# EAGLE design fatayshield (EAGLE 9.6.0)
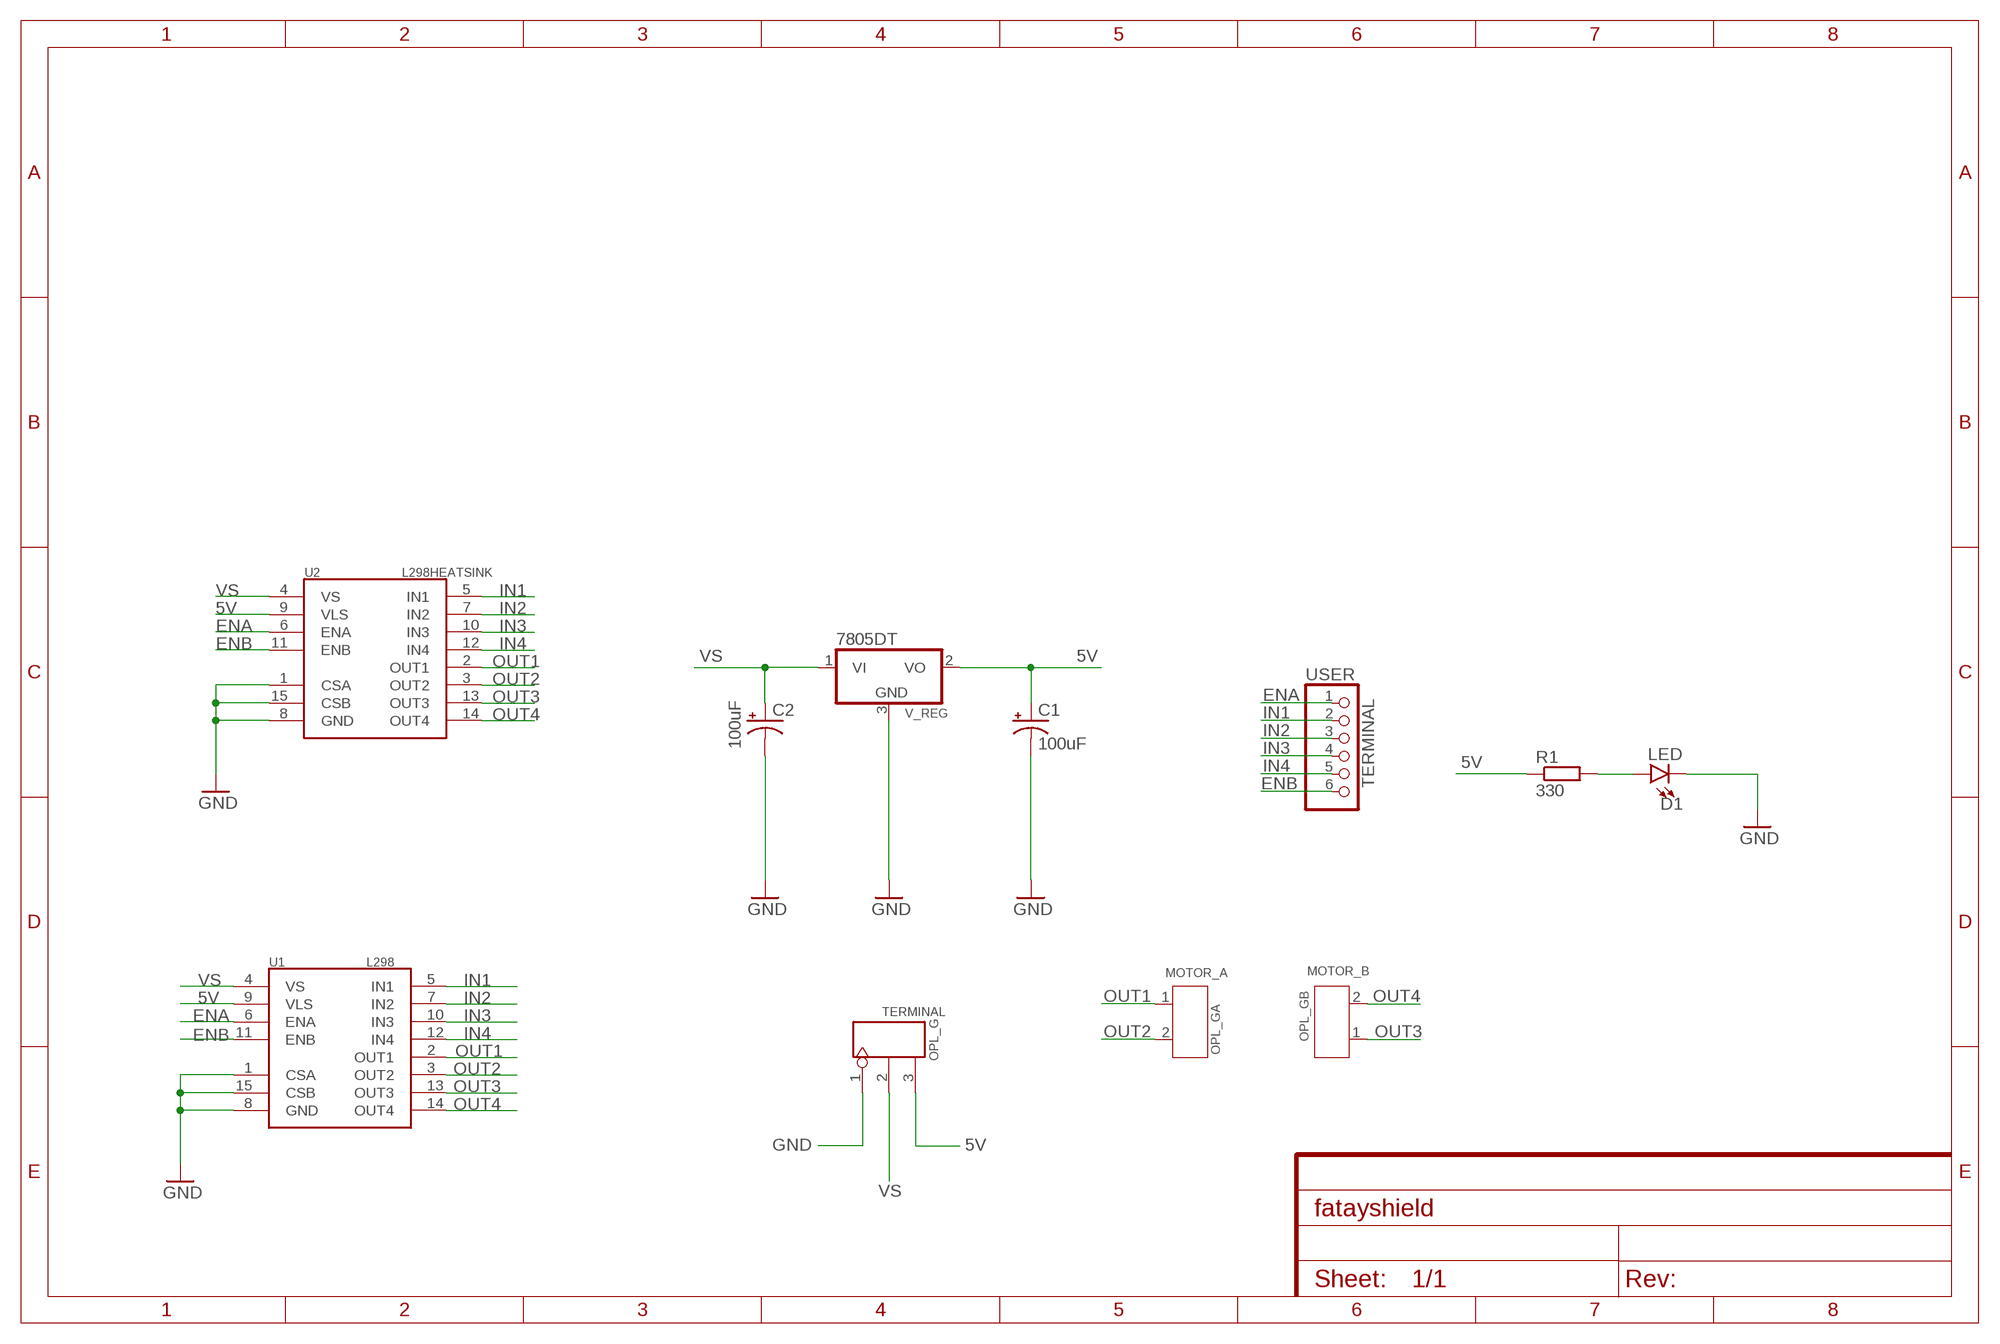
[diagram p0: schematic, sheet 1]

## Parts
C1  100uF  CPOL-USD  [PANASONIC_D]
C2  100uF  CPOL-USD  [PANASONIC_D]
D1  LED  LED-RED0603  [LED-0603]
OPL_GA  MOTOR_A  SCREW-TERMINAL-GREEN(2P-3.5)  [H2-3.5-7.0X7.0MM]
OPL_GB  MOTOR_B  SCREW-TERMINAL-GREEN(2P-3.5)  [H2-3.5-7.0X7.0MM]
R1  330  R-EU_R0805  [R0805]
TERMINAL  OPL_G  SCREW-TERMINAL-GREEN(3P-5.0)  [H3-5.0-15.5X8.0MM]
U1  L298  [MULTIWATT15]
U2  L298HEATSINK  [MULTIWATT15_6400BGHEATSINK]
USER  TERMINAL  PINHD-1X6-3.5MM  [1X06-3.5MM]
V_REG  7805DT  [TO252]

## Nets
5V: C1.+ R1.1 TERMINAL.3 U1.9(VLS) U2.9(VLS) V_REG.2(VO)
ENA: U1.6(ENA) U2.6(ENA) USER.1
ENB: U1.11(ENB) U2.11(ENB) USER.6
GND: C1.- C2.- D1.C TERMINAL.1 U1.1(CSA) U1.8(GND) U1.15(CSB) U2.1(CSA) U2.8(GND) U2.15(CSB) V_REG.3(GND)
IN1: U1.5(IN1) U2.5(IN1) USER.2
IN2: U1.7(IN2) U2.7(IN2) USER.3
IN3: U1.10(IN3) U2.10(IN3) USER.4
IN4: U1.12(IN4) U2.12(IN4) USER.5
N$2: D1.A R1.2
OUT1: OPL_GA.1 U1.2(OUT1) U2.2(OUT1)
OUT2: OPL_GA.2 U1.3(OUT2) U2.3(OUT2)
OUT3: OPL_GB.1 U1.13(OUT3) U2.13(OUT3)
OUT4: OPL_GB.2 U1.14(OUT4) U2.14(OUT4)
VS: C2.+ TERMINAL.2 U1.4(VS) U2.4(VS) V_REG.1(VI)

## Library data of the parts
C1 C2 = adafruit:CPOL-US: POLARIZED CAPACITOR, American symbol
D1 = SparkFun-LED:LED-RED: Red SMD LED Used in manufacturing of most products at SparkFun Packages: 0603 - SMD 0603 package [Product Link] <http://docs.avagotech.com/docs/AV02-0551EN> 0603 SMART - SMD 0603 SMART package ( more efficient and expensive)[Product Link] <http://www.osram-os.com/Graphics/XPic2/00077099_0.pdf> 1206 - SMD1206 package [Product Link] <https://www.sparkfun.com/datasheets/DevTools/LilyPad/Q150OVS4.pdff> SparkFun Products: Pro Mini 328 -5V <https://www.sparkfun.com/products/821> RedBoard <https://www.sparkfun.com/products/12757> IOIO-OTG <https://www.sparkfun.com/products/13613>; PROD_ID: DIO-00819; VALUE: RED
OPL_GA OPL_GB = OPL_Connector:SCREW-TERMINAL-GREEN(2P-3.5): 320110028; VALUE: GREEN-2P-3.5
R1 = rcl:R-EU_: RESISTOR, European symbol; SPICEPREFIX: R
TERMINAL = OPL_Connector:SCREW-TERMINAL-GREEN(3P-5.0): 320110029; VALUE: GREEN-3P-5.0
U1 U2 = SparkFun-IC-Special-Function:L298: L298 Dual Full Bridge Driver
USER = adafruit:PINHD-1X6: PIN HEADER
V_REG = adafruit:78*: Positive VOLTAGE REGULATOR Added bigger pads to the TO-92 package

## Board
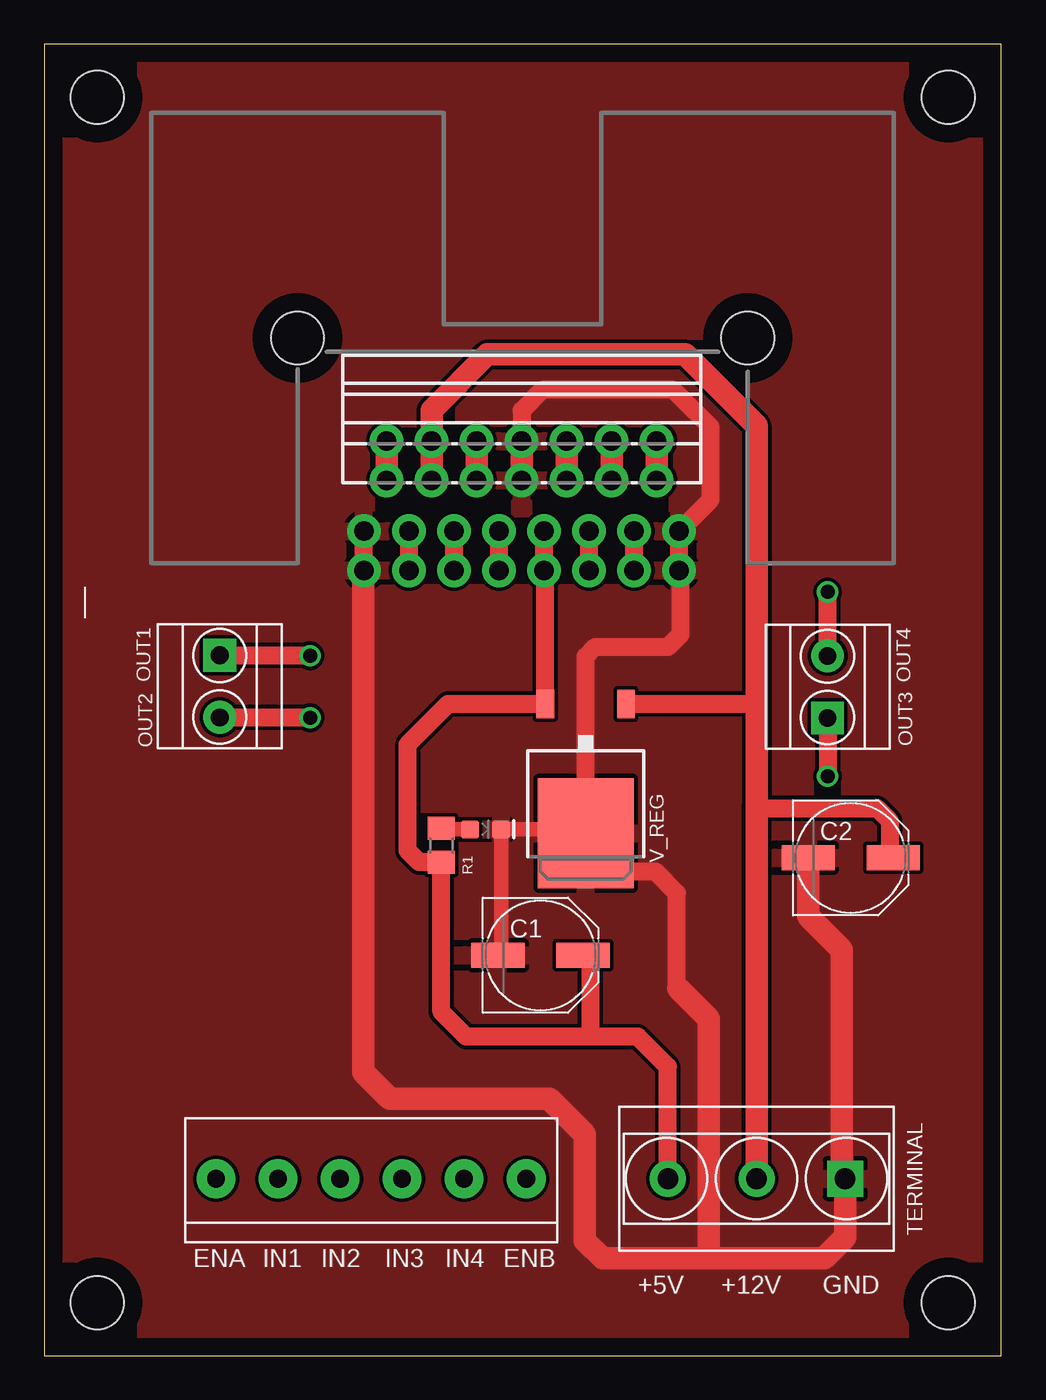
[diagram p1: board, top side]
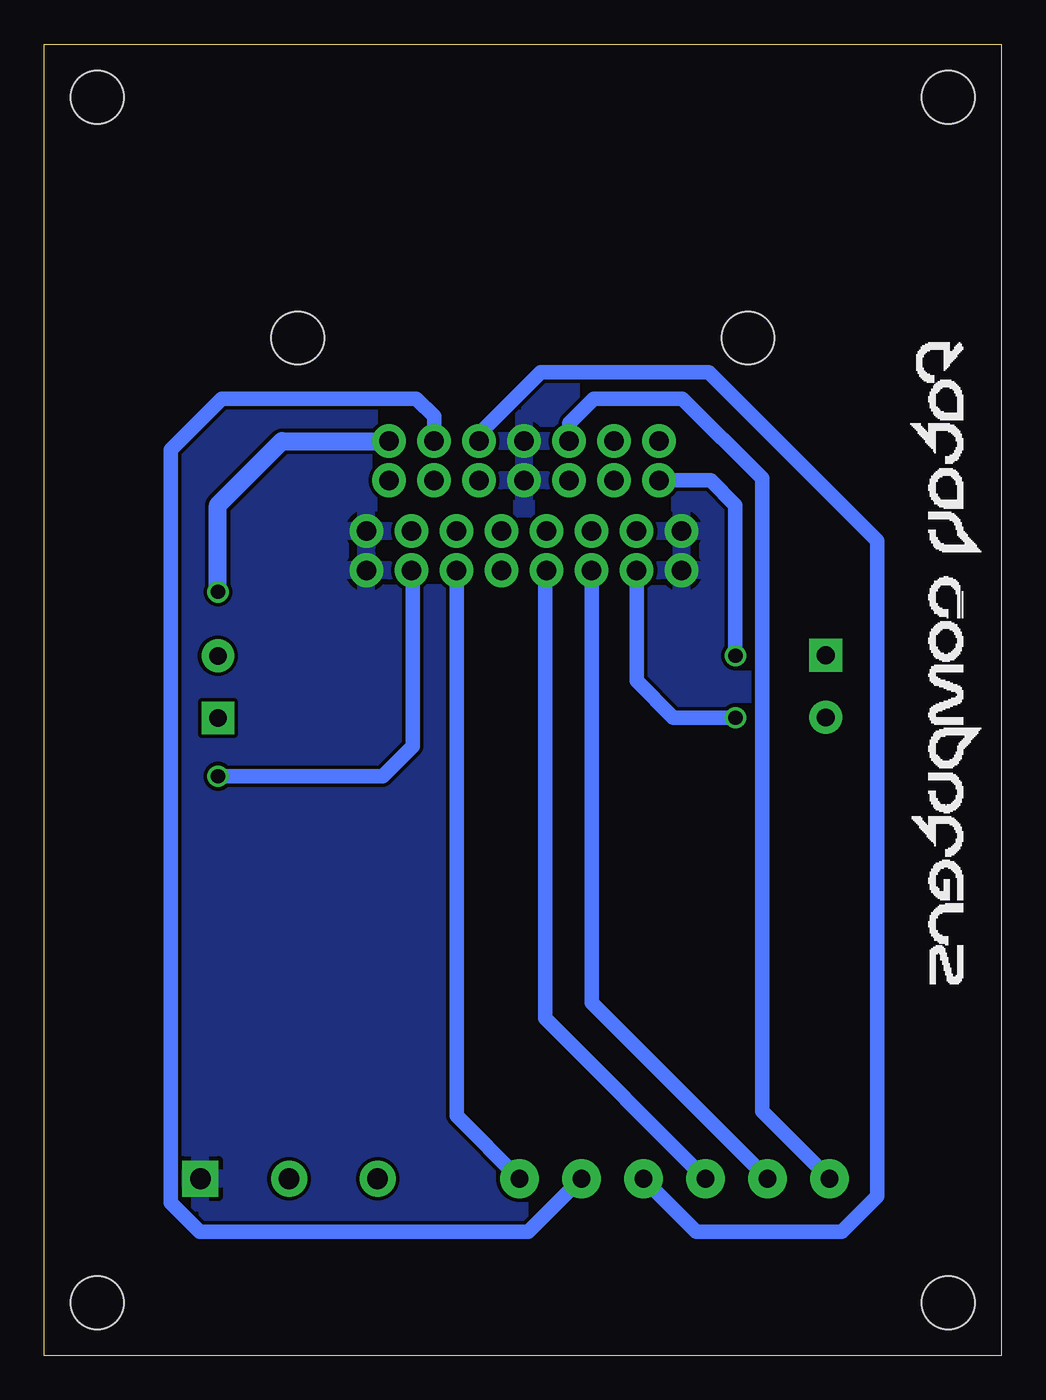
[diagram p2: board, bottom side, seen from below]

Size 54 x 74 mm. Coordinates in mm from the lower left corner, seen from the top.
Outline: 0,0 54,0 54,74 0,74 0,0
Copper layers (1*16): Top 0.035mm / dielectric 1.5mm / Bottom 0.035mm
Design rules "PCBway": minimum track width 6mil, minimum drill 0.3mm, track to track 0.205mm, track to pad 0.205mm, pad to pad 0.205mm, via to via 0.205mm, smd to smd 8mil, copper to edge 40mil, drill to drill 8mil, minimum pad ring 10mil, minimum via ring 8mil, stop-mask expansion 4mil, vias tented up to drill 25mil, thermal gap 10mil
Holes 3 mm at 3,71 51,71 51,3 3,3

### Footprints (pad centres in the part's own frame; a part is rotated, then mirrored left to right if it is on the bottom)
PANASONIC_D = smd 3 x 1.4: + 2.4,0; - -2.4,0
LED-0603 = smd 1 x 1: A -0.877,0; C 0.877,0
H2-3.5-7.0X7.0MM = drill 1 pad 1.85 square: 1 -1.75,0 | drill 1 pad 1.85: 2 1.75,0
R0805 = smd 1.3 x 1.5: 1 -0.95,0; 2 0.95,0
H3-5.0-15.5X8.0MM = drill 1.168 pad 2.032 square: 1 0,5 | drill 1.168 pad 2.032: 2 0,0; 3 0,-5
MULTIWATT15 = drill 1.1 pad 1.9: 1 -8.95,-2.39; 2 -7.68,2.69; 3 -6.41,-2.39; 4 -5.14,2.69; 5 -3.87,-2.39; 6 -2.6,2.69; 7 -1.33,-2.39; 8 -0.06,2.69; 9 1.21,-2.39; 10 2.48,2.69; 11 3.75,-2.39; 12 5.02,2.69; 13 6.29,-2.39; 14 7.56,2.69; 15 8.83,-2.39
MULTIWATT15_6400BGHEATSINK = drill 1.1 pad 1.9: 1 -8.95,-2.39; 2 -7.68,2.69; 3 -6.41,-2.39; 4 -5.14,2.69; 5 -3.87,-2.39; 6 -2.6,2.69; 7 -1.33,-2.39; 8 -0.06,2.69; 9 1.21,-2.39; 10 2.48,2.69; 11 3.75,-2.39; 12 5.02,2.69; 13 6.29,-2.39; 14 7.56,2.69; 15 8.83,-2.39 | hole 2.997: -12.7,8.509; 12.7,8.509
1X06-3.5MM = drill 1 pad 2.184: 1 -8.75,0; 2 -5.25,0; 3 -1.75,0; 4 1.75,0; 5 5.25,0; 6 8.75,0
TO252 = smd 1 x 1.6: 1 -2.28,-4.8; 2 2.28,-4.8 | smd 5.4 x 6.2: 3 0,2.5

### Placement (x,y rotation side)
C1  28,22.6 0 top
C2  45.5,28.1 0 top
D1  24.9,29.7 0 top
OPL_GA  9.9,37.77 270 top
OPL_GB  44.2,37.74 90 top
R1  22.4,28.8 90 top
TERMINAL  40.19,9.99 270 top
U1  26.99,46.71 0 top
U2  26.99,48.92 0 top
USER  18.44,9.99 0 top
V_REG  30.55,31.98 180 top

### Tracks (layer width: path | path; a pad name or v marks a point on that pad's centre or on a via)
5V
  Top 1.016: U2.9 U1.9 28.27,44.25 V_REG.2 22.78,36.78 20.5,34.5 20.5,28.5 21.15,27.85 R1.1 22.4,19.4 23.8,18 30.8,18 | TERMINAL.3 35.19,16.31 33.5,18 30.8,18 | C1.+ 30.8,22.2 30.8,18
ENA
  Top 1.27: U1.6 U2.6
  Bottom 0.813: U2.6 24.39,52.61 23,54 18,54 13.5,49.5 13.5,13.8 USER.1
ENB
  Top 1.016: U1.11 U2.11
  Bottom 0.813: USER.6 30.74,13.54 U1.11
GND
  Top 0.813: C1.- 25.78,22.78 25.78,27.4 D1.C 30.33,29.7 V_REG.3
  Top 1.016: U1.1 U2.1 | V_REG.3 30.55,30 | 30.55,30 30.55,39.45 31.1,40 35.2,40 35.9,40.7 35.9,44.24 U1.15 U2.15 37.6,48.31 37.6,52.4 35.5,54.5 28.1,54.5 26.93,53.33 U2.8 | 30.45,29.9 30.55,30 | 35.77,20.73 35.7,20.8 35.7,26.1 34.49,27.31 32.19,27.31
  Top 1.27: U1.1 18,44.28 18,16 19.5,14.5 28.5,14.5 30.5,12.5 30.5,6.5 31.5,5.5 37.5,5.5 | 37.5,5.5 44,5.5 45.19,6.69 TERMINAL.1 45,10.18 45,22.9 43.1,24.8 C2.- | 37.5,5.5 37.5,19 35.77,20.73 | U1.8 U2.8 | V_REG.3 30.55,28.95 32.19,27.31
  pour Top: 54.5,74.5 54.5,-0.5 -0.5,-0.5 -0.5,74.5
  pour Bottom: -0.5,-0.5 54.7,-0.5 54.7,73.6 54.6,73.7 -0.7,73.7
IN1
  Top 1.016: U1.5 U2.5
  Bottom 0.813: USER.2 23.12,19.92 U1.5
IN2
  Top 1.016: U1.7 U2.7
  Bottom 0.61: 25.74,44.24 U1.7
  Bottom 0.813: 25.74,44.24 25.74,19.04 USER.3
IN3
  Top 1.27: U1.10 U2.10
  Bottom 0.813: USER.4 17.2,7 9,7 7,9 7,46 16.5,55.5 26,55.5 29.47,52.03 U2.10
IN4
  Top 1.27: U1.12 U2.12
  Bottom 0.813: USER.5 26.68,7 45.22,7 46.87,8.64 46.87,51.13 44,54 33,54 32.01,53.01 U2.12
N$2
  Top 0.813: D1.A 22.45,29.7 R1.2
  Top 1.016: 22.55,29.9 R1.2
OUT1  (via drill 0.8)
  Top 1.016: OPL_GA.1 14.98,39.52 v15,39.5
  Top 1.27: U2.2 U1.2
  Bottom 0.813: v15,39.5 15,48 16.4,49.4 U1.2
OUT2  (via drill 0.8)
  Top 1.016: U1.3 U2.3 | OPL_GA.2 14.98,36.02 v15,36
  Bottom 0.813: U1.3 20.58,38.08 18.5,36 v15,36
OUT3  (via drill 0.8)
  Top 1.016: U1.13 U2.13 | OPL_GB.1 v44.2,32.7
  Bottom 0.813: v44.2,32.7 34.9,32.7 33.2,34.4 33.2,44.24
  Bottom 1.016: 33.2,44.24 U1.13
OUT4  (via drill 0.8)
  Top 1.016: OPL_GB.2 v44.2,43.1
  Top 1.27: U1.14 U2.14
  Bottom 1.016: v44.2,43.1 44.2,48 40.59,51.61 U2.14
VS
  Top 1.016: V_REG.1 39.97,36.78 40.19,37 | 40.19,31 40.29,30.9 47,30.9 47.7,30.2 47.7,28.3 C2.+
  Top 1.27: TERMINAL.2 40.19,29.9 40.19,31 40.19,37 40.19,52.48 36.16,56.5 25,56.5 21.85,53.35 U2.4 U1.4

### Text on the board
tPlace: OUT1 | OUT4 | OUT2 | OUT3 | ENA | IN1 | IN2 | IN3 | IN4 | ENB | +5V | +12V | GND